# EAGLE design MuscleMouse (EAGLE 6.2)
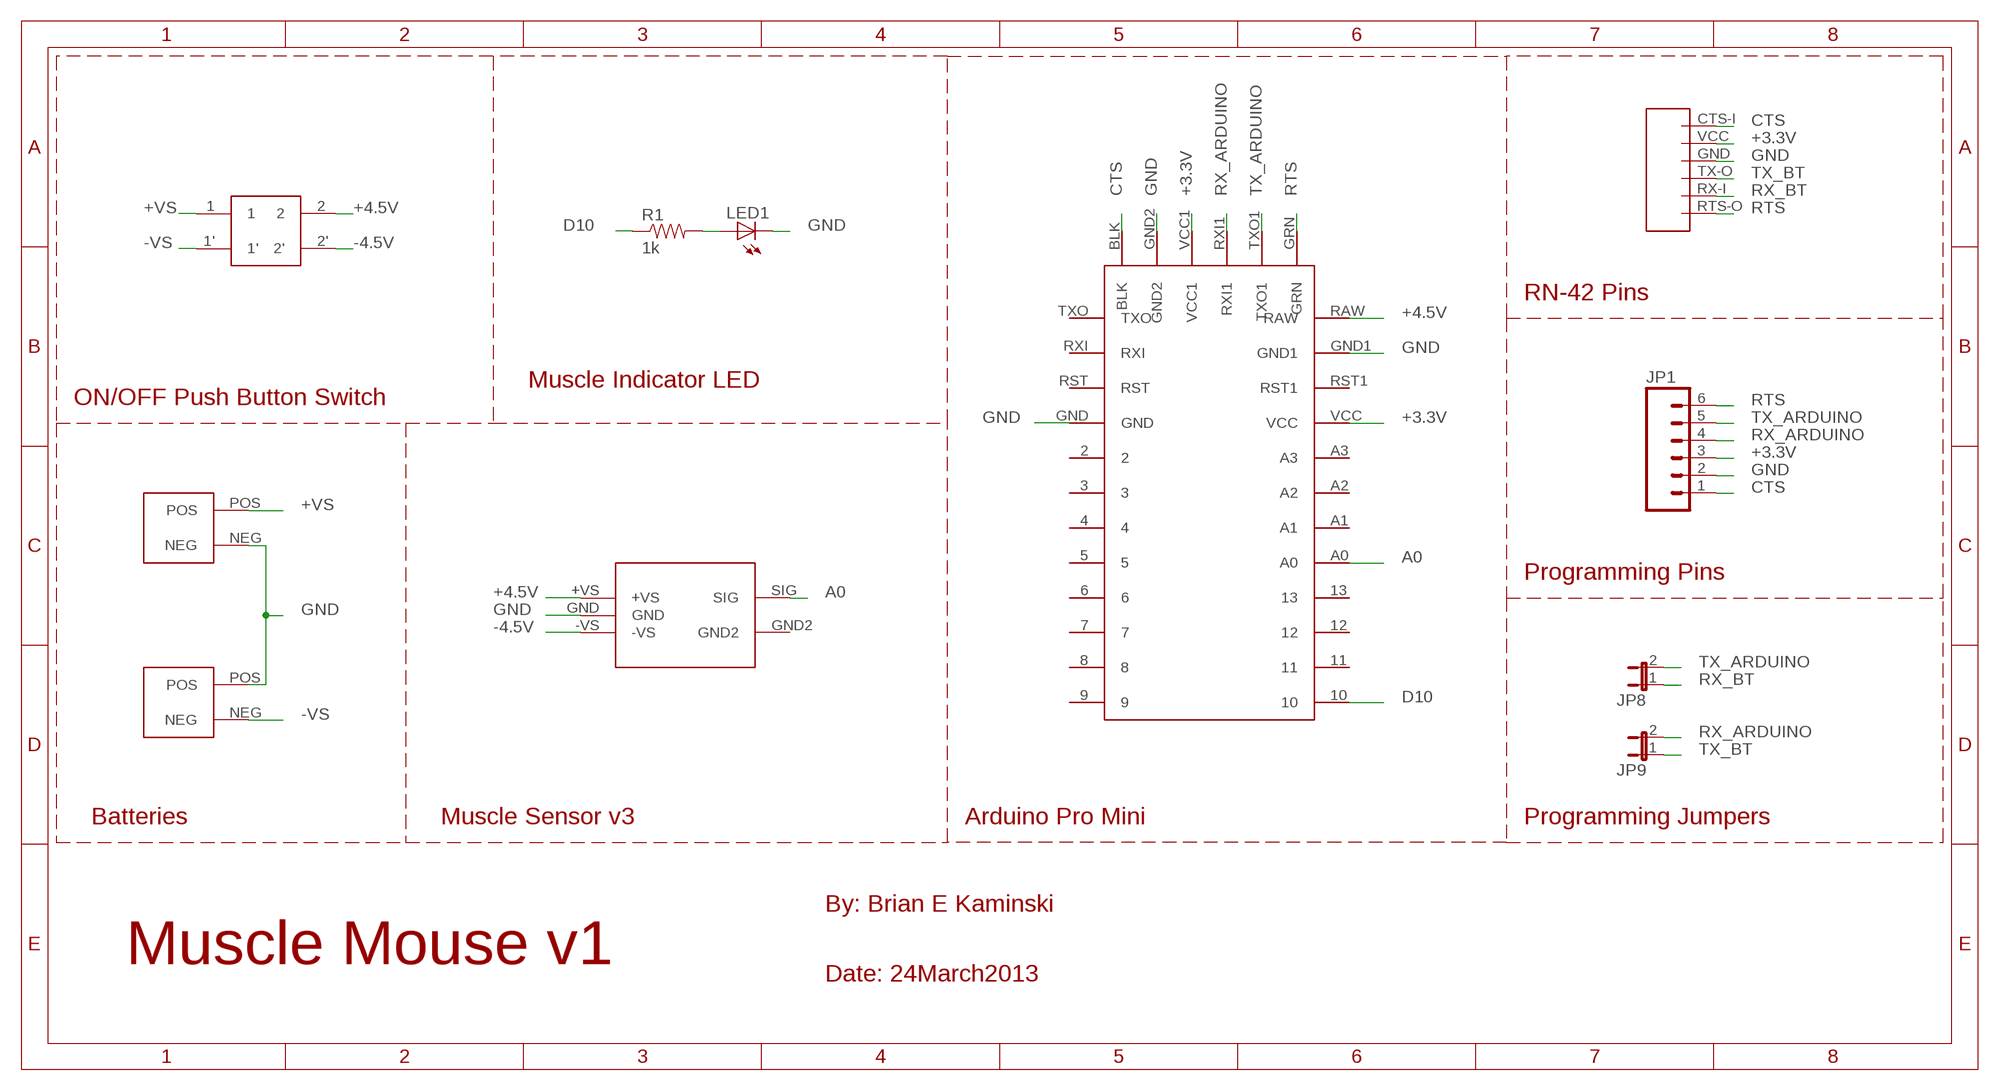
[diagram p0: schematic, sheet 1, part 1 of 2]
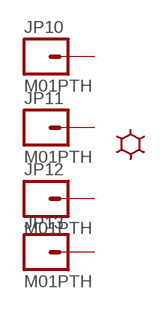
[diagram p1: schematic, sheet 1, part 2 of 2]

## Parts
JP1  M06SIP  [1X06]
JP8  JUMPER-2SMD-NC  [SJ_2S]
JP9  JUMPER-2SMD-NC  [SJ_2S]
JP10  M01PTH  [1X01]
JP11  M01PTH  [1X01]
JP12  M01PTH  [1X01]
JP13  M01PTH  [1X01]
LED1  LED0603  [LED-0603]
R1  1k  RESISTOR1206  [1206]
U$1  AAA_BATT_HOLDER_3STACK  [AAA_BATT_HOLDER_3STACK]
U$2  AAA_BATT_HOLDER_3STACK  [AAA_BATT_HOLDER_3STACK]
U$3  BLUESMIRF_HID  [BLUESMIRF_HID]
U$4  MUSCLE_SENSOR_V3  [MUSCLE_SENSOR_V3]
U$5  ARDUINO_PRO_MINI  [ARDUINO_PRO_MINI]
U$6  ON_OFF_BUTTON  [ON_OFF_BUTTON]
U$7  LOGOBIG  [LOGO_BIG]

## Nets
+3.3V: JP1.3 U$3.VCC U$5.VCC U$5.VCC1
+4.5V: U$4.+VS U$5.RAW U$6.2
+VS: U$1.POS U$6.1
-4.5V: U$4.-VS U$6.2'
-VS: U$2.NEG U$6.1'
A0: U$4.SIG U$5.A0
CTS: JP1.1 U$3.CTS-I U$5.BLK
D10: R1.1 U$5.10
GND: JP1.2 LED1.C U$1.NEG U$2.POS U$3.GND U$4.GND U$5.GND U$5.GND1 U$5.GND2
N$1: LED1.A R1.2
RTS: JP1.6 U$3.RTS-O U$5.GRN
RX_ARDUINO: JP1.4 JP9.2 U$5.RXI1
RX_BT: JP8.1 U$3.RX-I
TX_ARDUINO: JP1.5 JP8.2 U$5.TXO1
TX_BT: JP9.1 U$3.TX-O
Unconnected: JP10.1 JP11.1 JP12.1 JP13.1 U$4.GND2 U$5.2 U$5.3 U$5.4 U$5.5 U$5.6 U$5.7 U$5.8 U$5.9 U$5.11 U$5.12 U$5.13 U$5.A1 U$5.A2 U$5.A3 U$5.RST U$5.RST1 U$5.RXI U$5.TXO

## Notes on the sheet
- RN-42 Pins
- Muscle Indicator LED
- ON/OFF Push Button Switch
- Programming Pins
- Batteries | Muscle Sensor v3 | Arduino Pro Mini | Programming Jumpers
- By: Brian E Kaminski
- Muscle Mouse v1
- Date: 24March2013

## Library data of the parts
JP1 = SparkFunJan2012:M06: Header 6 Standard 6-pin 0.1" header. Use with straight break away headers (SKU : PRT-00116), right angle break away headers (PRT-00553), swiss pins (PRT-00743), machine pins (PRT-00117), and female headers (PRT-00115). Molex polarized connector foot print use with SKU : PRT-08094 with associated crimp pins and housings. NOTES ON THE VARIANTS LOCK and LOCK_LONGPADS... This footprint was designed to help hold the alignment of a through-hole component (i.e. 6-pin header) while soldering it into place. You may notice that each hole has been shifted either up or down by 0.005 of an inch from it's more standard position (which is a perfectly straight line). This slight alteration caused the pins (the squares in the middle) to touch the edges of the holes. Because they are alternating, it causes a "brace" to hold the component in place. 0.005 has proven to be the perfect amount of "off-center" position when using our standard breakaway headers. Although looks a little odd when you look at the bare footprint, once you have a header in there, the alteration is very hard to notice. Also, if you push a header all the way into place, it is covered up entirely on the bottom side. This idea of altering the position of holes to aid alignment will be further integrated into the Sparkfun Library for other footprints. It can help hold any component with 3 or more connection pins.
JP8 JP9 = SparkFun:JUMPER-2: Jumper Basic 0.1" spaced jumper. Use with breakaway headers.
JP10-JP13 = SparkFunJan2012:M01: Header 1 Standard 1-pin 0.1" header. Use with straight break away headers (SKU : PRT-00116), right angle break away headers (PRT-00553), swiss pins (PRT-00743), machine pins (PRT-00117), and female headers (PRT-00115).
LED1 = SparkFunJan2012:LED: LEDs Standard schematic elements and footprints for 5mm, 3mm, 1206, and 0603 sized LEDs. 5mm - Spark Fun Electronics SKU : COM-00529 (and others)
R1 = SparkFunJan2012:RESISTOR: Resistor Basic schematic elements and footprints for 0603, 1206, and PTH resistors.
U$1 U$2 = advancer-technologies:AAA_BATT_HOLDER_3STACK: Digi-Key Part Number: 2479K-ND Manufacturer: Keystone Electronics HOLDER BATTERY 3CELL AAA PC MNT http://www.digikey.com/product-detail/en/2479/2479K-ND/303824
U$3 = advancer-technologies:BLUESMIRF_HID
U$4 = advancer-technologies:MUSCLE_SENSOR_V3
U$5 = advancer-technologies:ARDUINO_PRO_MINI
U$6 = advancer-technologies:ON_OFF_BUTTON
U$7 = advancer-technologies:LOGO

## Board
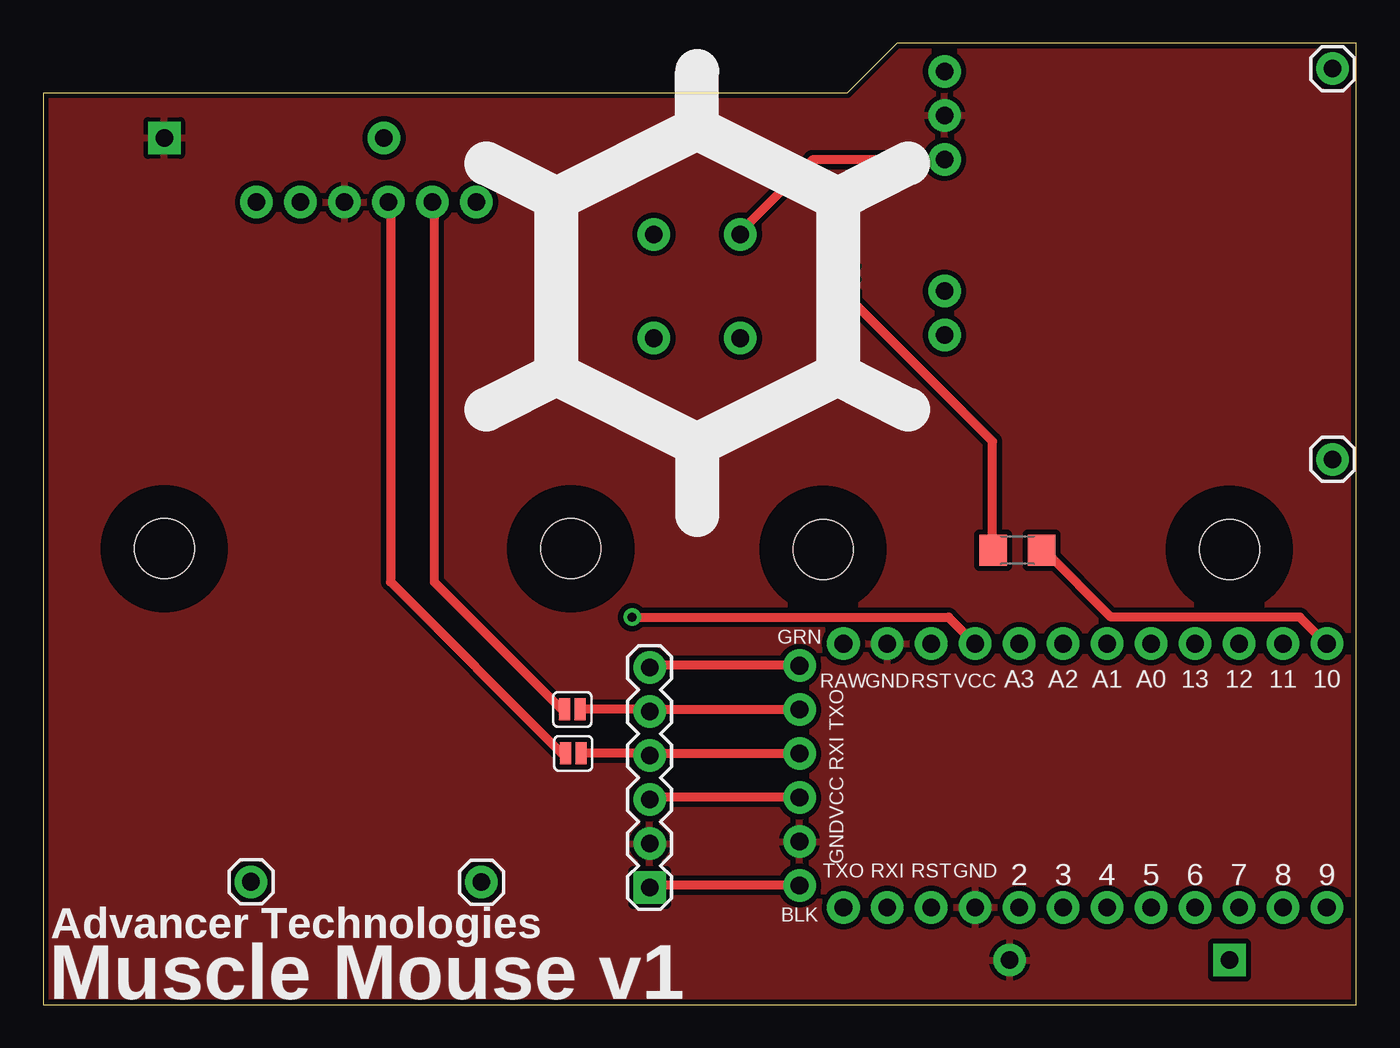
[diagram p2: board, top side]
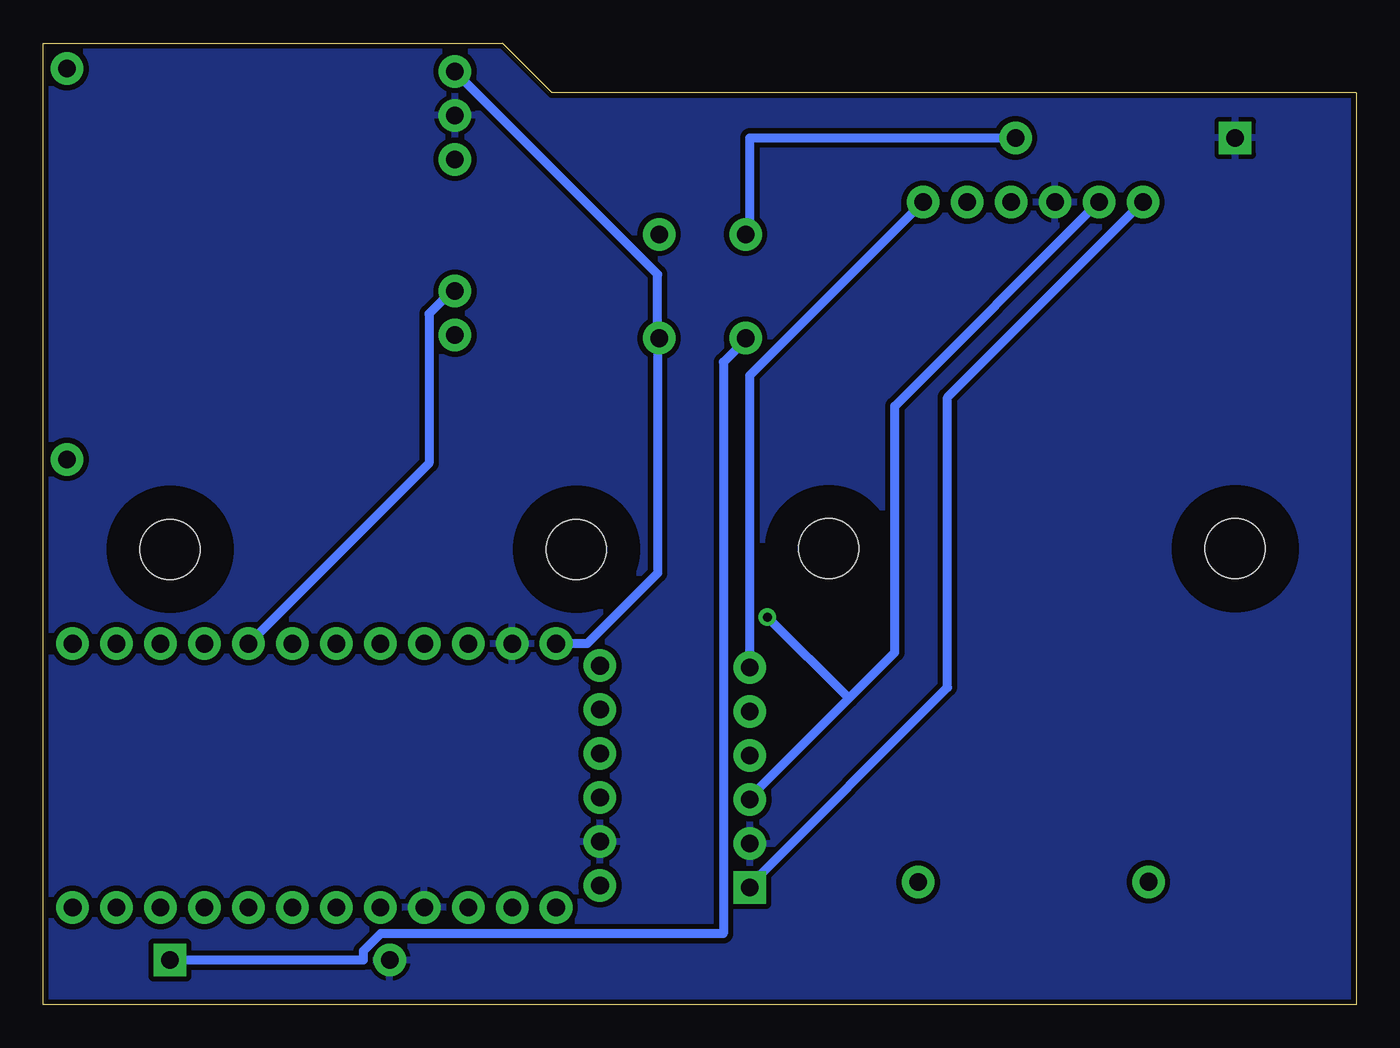
[diagram p3: board, bottom side, seen from below]

Size 75.9 x 55.55 mm. Coordinates in mm from the lower left corner, seen from the top.
Outline: 0,0 75.89,0 75.89,55.55 49.35,55.55 46.49,52.69 0,52.69 0,0
Copper layers (1*16): Top 0.035mm / dielectric 1.5mm / Bottom 0.035mm
Design rules: minimum track width 20mil, minimum drill 20mil, track to track 8mil, track to pad 8mil, pad to pad 8mil, via to via 8mil, smd to smd 8mil, copper to edge 10mil, drill to drill 8mil, minimum pad ring 12mil, minimum via ring 10mil, stop-mask expansion 4mil, vias tented up to drill 25mil, thermal gap 10mil

### Footprints (pad centres in the part's own frame; a part is rotated, then mirrored left to right if it is on the bottom)
1X06 = drill 1.016 pad 1.88 square: 1 0,0 | drill 1.016 pad 1.88: 2 2.54,0; 3 5.08,0; 4 7.62,0; 5 10.16,0; 6 12.7,0
SJ_2S = smd 0.635 x 1.27: 1 -0.45,0; 2 0.45,0
1X01 = drill 1.016 pad 1.88: 1 0,0
LED-0603 = smd 0.8 x 0.8: A 0,-0.75; C 0,0.75
1206 = smd 1.6 x 1.8: 1 -1.4,0; 2 1.4,0
AAA_BATT_HOLDER_3STACK = drill 1.016 pad 1.88: NEG 0,12.713 | drill 1.016 pad 1.88 square: POS 0,0.013 | hole 3.454: -23.724,23.508; -23.724,0.013
BLUESMIRF_HID = drill 1.016 pad 1.88: CTS-I 0,12.7; GND 0,7.62; RTS-O 0,0; RX-I 0,2.54; TX-O 0,5.08; VCC 0,10.16
MUSCLE_SENSOR_V3 = drill 1.016 pad 1.88: +VS 1.6,-1.6; -VS 1.6,-6.68; GND 1.6,-4.14; GND2 1.6,-16.84; SIG 1.6,-14.3
ARDUINO_PRO_MINI = drill 1.016 pad 1.88: 2 -7.62,2.54; 3 -7.62,0; 4 -7.62,-2.54; 5 -7.62,-5.08; 6 -7.62,-7.62; 7 -7.62,-10.16; 8 -7.62,-12.7; 9 -7.62,-15.24; 10 7.62,-15.24; 11 7.62,-12.7; 12 7.62,-10.16; 13 7.62,-7.62; A0 7.62,-5.08; A1 7.62,-2.54; A2 7.62,0; A3 7.62,2.54; BLK -6.35,15.24; GND -7.62,5.08; GND1 7.62,10.16; GND2 -3.81,15.24; GRN 6.35,15.24; RAW 7.62,12.7; RST -7.62,7.62; RST1 7.62,7.62; RXI -7.62,10.16; RXI1 1.27,15.24; TXO -7.62,12.7; TXO1 3.81,15.24; VCC 7.62,5.08; VCC1 -1.27,15.24
ON_OFF_BUTTON = drill 1.016 pad 1.88: 1 1.6,7.4; 1' 7.6,7.4; 2 1.6,2.4; 2' 7.6,2.4

### Placement (x,y rotation side)
JP1  35.05,6.77 90 top
JP8  30.58,17.06 0 top
JP9  30.63,14.52 0 top
JP10  12.01,7.1 0 top
JP11  25.32,7.07 0 top
JP12  74.52,54.09 0 top
JP13  74.52,31.51 0 top
LED1  46.64,41.54 0 top
R1  56.31,26.25 180 top
U$1  68.58,2.58 270 bottom
U$2  6.99,50.08 90 bottom
U$3  25.03,46.37 90 top
U$4  50.5,55.52 0 top
U$5  58.95,13.23 90 top
U$6  42.7,36.91 90 top
U$7  37.8,42.51 0 bottom

### Tracks (layer width: path | path; a pad name or v marks a point on that pad's centre or on a via)
+3.3V  (via drill 0.51)
  Top 0.508: JP1.3 35.05,11.98 43.69,11.98 U$5.VCC1 | v34.04,22.39 52.32,22.39 53.85,20.87 U$5.VCC
  Bottom 0.508: 29.34,17.69 35.05,11.98 JP1.3 | 29.34,17.69 26.67,20.36 26.67,34.58 14.99,46.27 U$3.VCC | 29.34,17.69 v34.04,22.39
+4.5V
  Bottom 0.508: U$5.RAW 46.23,20.87 44.45,20.87 40.39,24.93 40.39,38.39 U$6.2 40.39,38.65 40.39,42.2 52.07,53.89 U$4.+VS
+VS
  Bottom 0.508: U$1.POS 57.4,2.58 57.4,3.09 56.39,4.1 36.58,4.1 36.58,37.12 35.31,38.39 U$6.1
-4.5V
  Top 0.508: U$6.2' 40.39,44.74 44.45,48.81 52.07,48.81 U$4.-VS
-VS
  Bottom 0.508: U$2.NEG 35.05,50.08 35.05,44.74 U$6.1'
A0
  Bottom 0.508: U$5.A0 64.01,20.87 53.59,31.28 53.59,39.92 52.32,41.19 U$4.SIG
CTS
  Top 0.508: JP1.1 35.05,6.9 43.69,6.9 U$5.BLK
  Bottom 0.508: U$3.CTS-I 12.45,46.27 23.62,35.09 23.62,18.33 35.05,6.9 JP1.1
D10
  Top 0.508: R1.1 57.91,26.2 61.72,22.39 72.64,22.39 74.17,20.87 U$5.10
GND
  pour Bottom (isolate 0.305): 0,58.33 0,0 75.93,0 75.93,58.33
  pour Top (isolate 0.305): 0,58.33 0,0.04 75.9,0.04 75.9,58.33
N$1
  Top 0.508: LED1.A 46.74,40.68 54.86,32.55 54.86,26.45 R1.2
RTS
  Top 0.508: JP1.6 35.05,19.6 43.69,19.6 U$5.GRN
  Bottom 0.508: JP1.6 35.05,36.36 25.15,46.27 U$3.RTS-O
RX_ARDUINO
  Top 0.508: 35.05,14.52 JP9.2 | 35.05,14.52 43.69,14.52 U$5.RXI1 | 35.05,14.52 JP1.4
RX_BT
  Top 0.508: JP8.1 29.97,17.06 22.61,24.42 22.61,46.27 U$3.RX-I
TX_ARDUINO
  Top 0.508: 35.05,17.06 JP8.2 | 35.05,17.06 43.69,17.06 U$5.TXO1 | 35.05,17.06 JP1.5
TX_BT
  Top 0.508: JP9.1 29.97,14.52 20.07,24.42 20.07,46.27 U$3.TX-O

### Text on the board
tPlace: Advancer Technologies | Muscle Mouse v1